# Altium schematic sheet AinCHr2.SchDoc
size A4
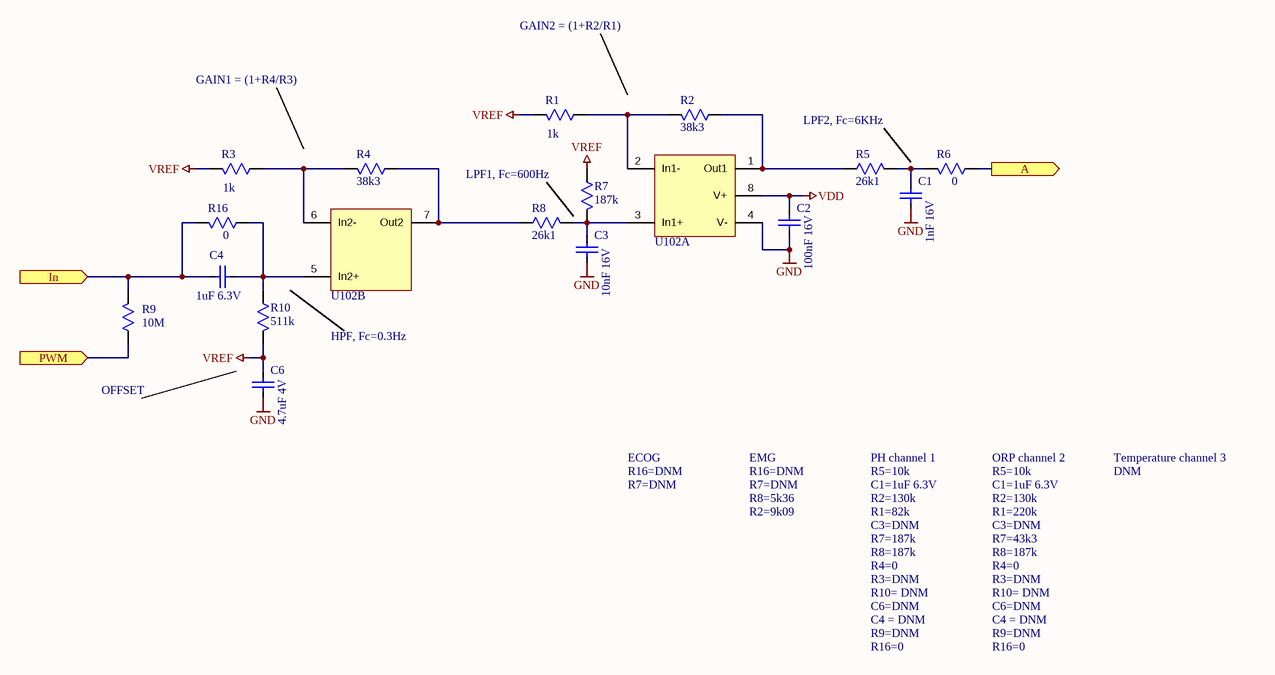
[diagram p0: AinCHr2.SchDoc]

## Parts
C1  1nF 16V  [CAPC0603L]
C2  100nF 16V  [CAPC0603L]
C3  10nF 16V  [CAPC0603L]
C4  1uF 6.3V  [CAPC0603L]
C6  4.7uF 4V  [CAPC0603L]
R1  1k  [RESC0603L]
R2  38k3  [RESC0603L]
R3  1k  [RESC0603L]
R4  38k3  [RESC0603L]
R5  26k1  [RESC0603L]
R6  0  [RESC0603L]
R7  187k  [RESC0603L]
R8  26k1  [RESC0603L]
R9  10M  [RESC0603L]
R10  511k  [RESC0603L]
R16  0  [RESC0603L]
U102  LMX358IQ2T  [SON50P200X60_HS-9L]  (value not drawn)  (parts A,B of 2)

## Ports
A (out), In (in), PWM (in)

## Nets
GND: C1.2 C2.2 C3.2 C6.2 U102.4(V-)
VDD: C2.1 U102.8(V+)
VREF: C6.1 R1.2 R3.2 R7.1 R10.2
A: R6.1 ; port A
In: C4.1 R9.2 R16.2 ; port In
PWM: R9.1 ; port PWM
NetC1_1: C1.1 R5.2 R6.2
NetC3_1: C3.1 R7.2 R8.2 U102.3(In1+)
NetC4_2: C4.2 R10.1 R16.1 U102.5(In2+)
NetR1_1: R1.1 R2.2 U102.2(In1-)
NetR2_1: R2.1 R5.1 U102.1(Out1)
NetR3_1: R3.1 R4.2 U102.6(In2-)
NetR4_1: R4.1 R8.1 U102.7(Out2)

## Notes on the sheet
- GAIN2 = (1+R2/R1)
- GAIN1 = (1+R4/R3)
- LPF1, Fc=600Hz
- (near R5) LPF2, Fc=6KHz
- HPF, Fc=0.3Hz
- OFFSET
- ECOG
- R16=DNM
- R7=DNM
- EMG
- R2=9k09
- R8=5k36
- PH channel 1
- R5=10k
- C1=1uF 6.3V
- R2=130k
- R1=82k
- ORP channel 2
- R1=220k
- Temperature channel 3
- DNM
- C3=DNM
- R7=187k
- R8=187k
- R4=0
- R3=DNM
- R7=43k3
- R10= DNM
- C6=DNM
- C4 = DNM
- R9=DNM
- R16=0

## Library data of the parts
C1 = Capacitor: CAT#: 490-6147-1-ND #Digikey; Value: 1nF 16V; Package: 0201
C2 = Capacitor: CAT#: 490-9985-1-ND #Digikey; Value: 100nF 16V; Package: 0201
C3 = Capacitor: CAT#: 490-7223-1-ND #Digikey; Value: 10nF 16V; Package: 0201
C4 = Capacitor: CAT#: 1276-1323-1-ND #Digikey; Value: 1uF 6.3V; Package: 0201
C6 = Capacitor: CAT#: 490-13229-1-ND #Digikey; Value: 4.7uF 4V; Package: 0201
R1 R3 = Resistor: CAT#: P1.00KABCT-ND #Digikey; Value: 1k; Package: 0201
R2 R4 = Resistor: CAT#: P38.3KABCT-ND #Digikey; Value: 38k3; Package: 0201
R5 R8 = Resistor: CAT#: P26.1KABCT-ND #Digikey; Value: 26k1; Package: 0201
R6 R16 = Resistor: CAT#: P15979CT-ND #Digikey; Value: 0; Package: 0201
R7 = Resistor: CAT#: P187KABCT-ND #Digikey; Value: 187k; Package: 0201
R9 = Resistor: CAT#: RHM10MCBCT-ND #Digikey; Value: 10M; Package: 0201
R10 = Resistor: CAT#: P511KABCT-ND #Digikey; Value: 511k; Package: 0201
U102 = LMX358: Operational Amplifier for Cost-Sensitive Systems; CAT#: 497-14860-1-ND #Digikey; Value: LMX358IQ2T